# EAGLE design UTJ-1 (EAGLE 9.4.2)
DESIGNER: Bradley L. Davis; PART_NUMBER: 68-0014; PROJECT: Solar Cell Simulator; REV: 1.0.0
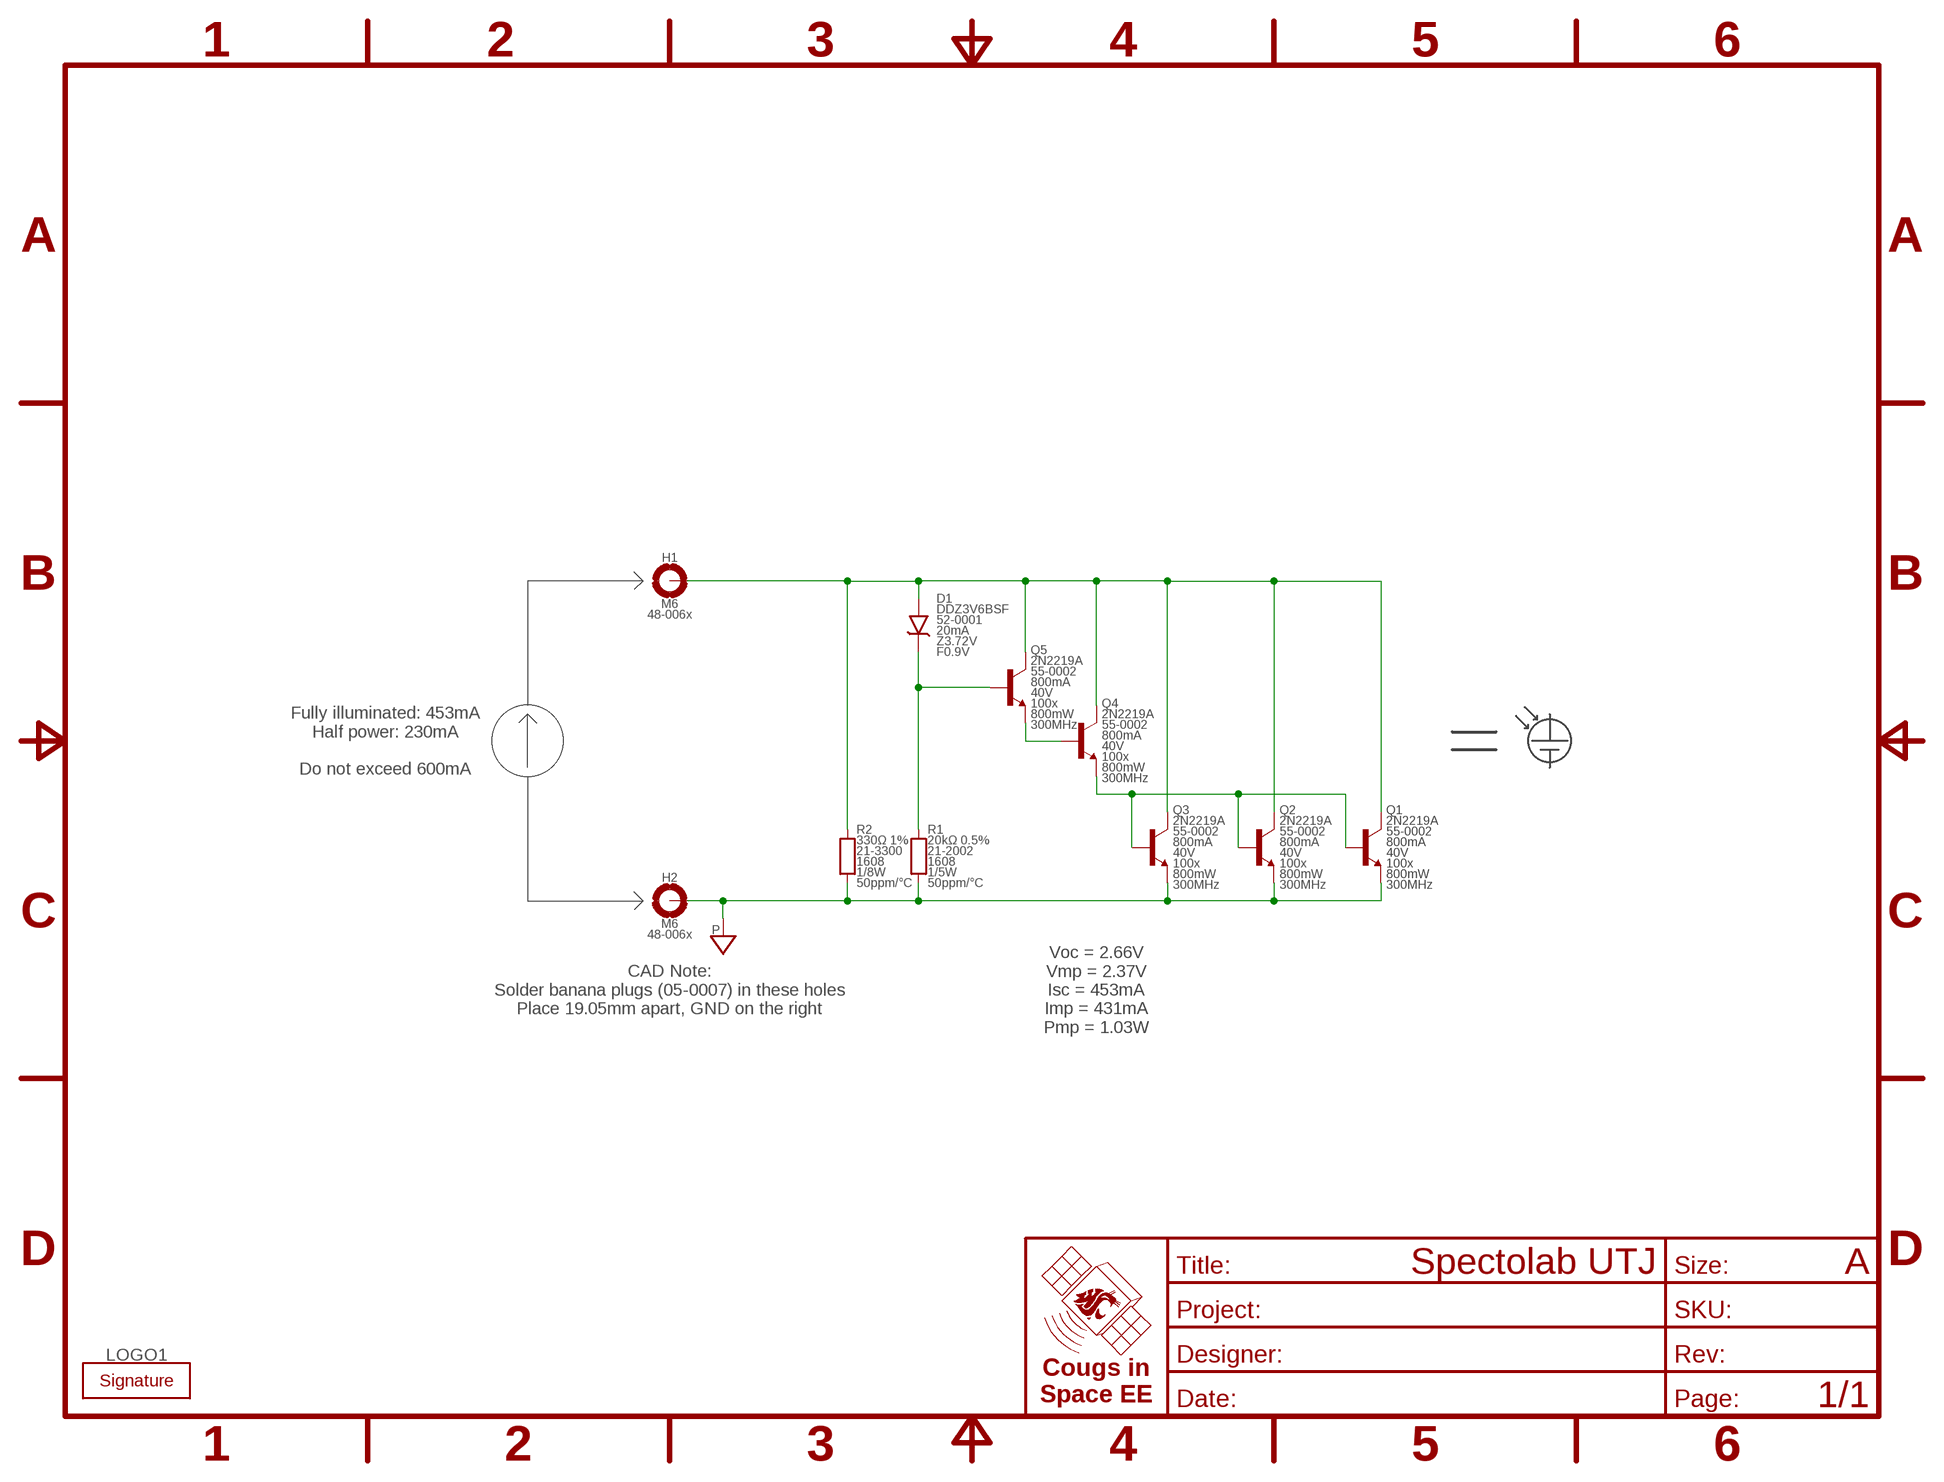
[diagram p0: schematic, sheet 1]
FRAME1 (FRAME-A): TITLE: Spectolab UTJ

## Parts
D1  DDZ3V6BSF  DIODE-ZENER-V-DDZ3V6BSF-SOD323F  [SOD323F]
H1  M6  MOUNTING_HOLE-6.6  [MOUNTING_HOLE-6.6]
H2  M6  MOUNTING_HOLE-6.6  [MOUNTING_HOLE-6.6]
LOGO1  SIGNATUREBRADLEY  [SIGN-BRADLEY]
Q1  2N2219A  BJT-NPN-2N2219A-TO-39  [TO-39]
Q2  2N2219A  BJT-NPN-2N2219A-TO-39  [TO-39]
Q3  2N2219A  BJT-NPN-2N2219A-TO-39  [TO-39]
Q4  2N2219A  BJT-NPN-2N2219A-TO-39  [TO-39]
Q5  2N2219A  BJT-NPN-2N2219A-TO-39  [TO-39]
R1  20kΩ 0.5%  RES-V-20K-1608  [1608]
R2  330Ω 1%  RES-V-330R-1608  [1608]

## Nets
CELL+: D1.A H1.1(MOUNT) H1.V1(MOUNT) H1.V2(MOUNT) H1.V3(MOUNT) H1.V4(MOUNT) H1.V5(MOUNT) H1.V6(MOUNT) H1.V7(MOUNT) H1.V8(MOUNT) H1.V9(MOUNT) H1.V10(MOUNT) H1.V11(MOUNT) H1.V12(MOUNT) H1.V13(MOUNT) H1.V14(MOUNT) H1.V15(MOUNT) H1.V16(MOUNT) Q1.3(C) Q2.3(C) Q3.3(C) Q4.3(C) Q5.3(C) R2.2
EMITTER-1: Q4.2(B) Q5.1(E)
EMITTER-2: Q1.2(B) Q2.2(B) Q3.2(B) Q4.1(E)
PGND: H2.1(MOUNT) H2.V1(MOUNT) H2.V2(MOUNT) H2.V3(MOUNT) H2.V4(MOUNT) H2.V5(MOUNT) H2.V6(MOUNT) H2.V7(MOUNT) H2.V8(MOUNT) H2.V9(MOUNT) H2.V10(MOUNT) H2.V11(MOUNT) H2.V12(MOUNT) H2.V13(MOUNT) H2.V14(MOUNT) H2.V15(MOUNT) H2.V16(MOUNT) Q1.1(E) Q2.1(E) Q3.1(E) R1.1 R2.1
ZENER_C: D1.C Q5.2(B) R1.2

## Notes on the sheet
- Fully illuminated: 453mA
  Half power: 230mA
  
  Do not exceed 600mA
- CAD Note:
  Solder banana plugs (05-0007) in these holes
  Place 19.05mm apart, GND on the right
- Voc = 2.66V
  Vmp = 2.37V
  Isc = 453mA
  Imp = 431mA
  Pmp = 1.03W

## Library data of the parts
D1 = CougsInSpace-DiscreteSemi:DIODE-ZENER-V: Diode Zener - Vertical; CURRENT: 20mA; SKU: 52-0001; VF: F0.9V; VZ: Z3.72V
H1 H2 = CougsInSpace-Hardware:MOUNTING_HOLE: Mounting Hole; SKU: 48-006x
LOGO1 = CougsInSpace-Aesthetics:SIGNATURE: Designer's (Artist's) Signature
Q1-Q5 = CougsInSpace-DiscreteSemi:BJT-NPN: Bipolar Junction Transistor - NPN; FREQ: 300MHz; GAIN: 100x; IMAX: 800mA; POWER: 800mW; SKU: 55-0002; VMAX: 40V
R1 = CougsInSpace-Resistors:RES-V: Resistor Vertical; PACKAGE: 1608; POWER: 1/5W; SKU: 21-2002; TEMP: 50ppm/°C
R2 = CougsInSpace-Resistors:RES-V: Resistor Vertical; PACKAGE: 1608; POWER: 1/8W; SKU: 21-3300; TEMP: 50ppm/°C

## Board
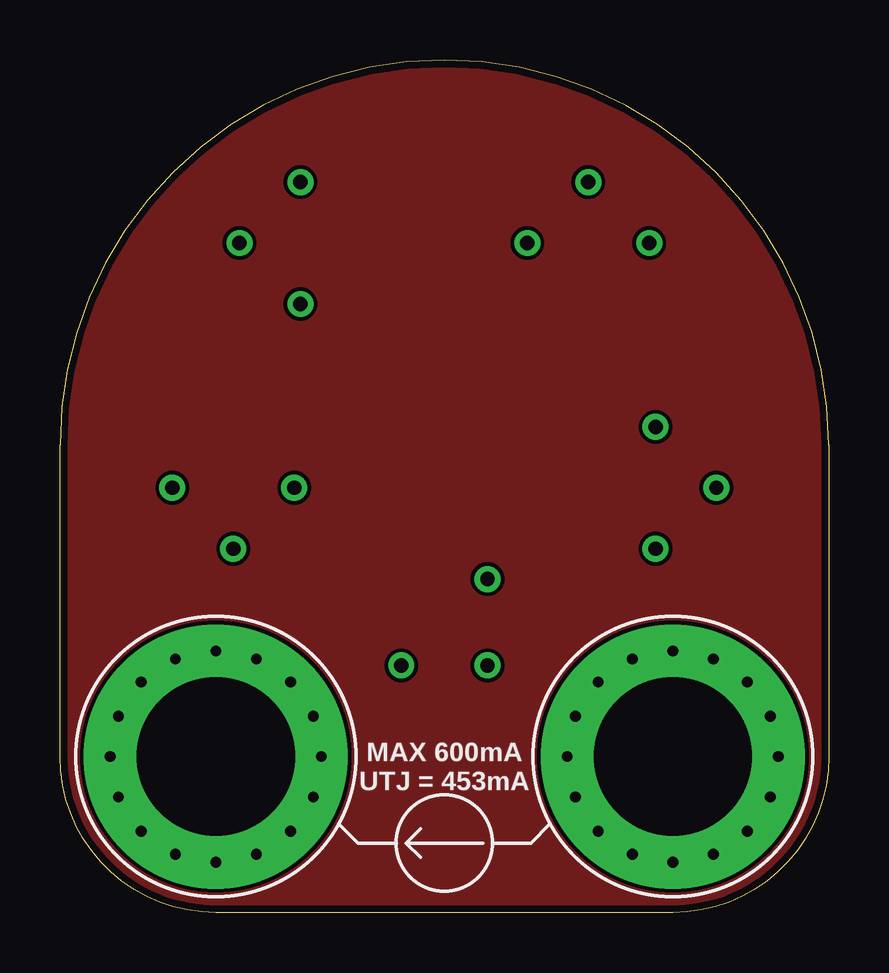
[diagram p1: board, top side]
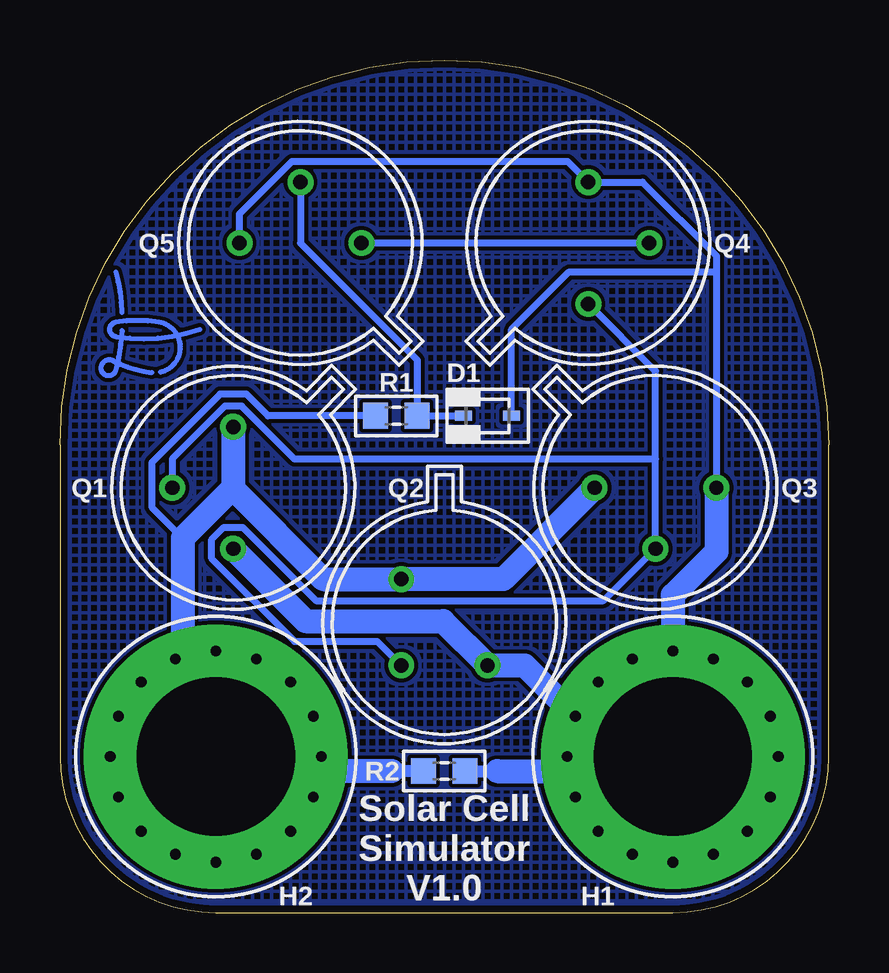
[diagram p2: board, bottom side, seen from below]

Size 32.05 x 35.52 mm. Coordinates in mm from the lower left corner, seen from the top.
Outline: 32.05,19.5 32.05,6.5 arc-90 25.55,0 6.5,0 arc-90 0,6.5 0,19.5 arc-180 32.05,19.5
Copper layers (1*16): Top 0.035mm / dielectric 1.6mm / Bottom 0.035mm
Design rules "CougsInSpace *": minimum track width 0.16mm, minimum drill 0.3mm, track to track 0.16mm, track to pad 0.16mm, pad to pad 0.16mm, via to via 0.16mm, smd to smd 0mil, copper to edge 0.3mm, drill to drill 0.3mm, minimum pad ring 0.15mm, minimum via ring 0.15mm, stop-mask expansion 0mil, vias tented up to drill 1mm, thermal gap 0.25mm

### Footprints (pad centres in the part's own frame; a part is rotated, then mirrored left to right if it is on the bottom)
SOD323F = smd 0.71 x 0.403: A 1,0; C -1,0
MOUNTING_HOLE-6.6 = drill 6.6 pad 11: 1 0,0 | drill 0.45: V1 4.4,0; V2 4.065,1.684; V3 3.111,3.111; V4 1.684,4.065; V5 0,4.4; V6 -1.684,4.065; V7 -3.111,3.111; V8 -4.065,1.684; V9 -4.4,0; V10 -4.065,-1.684; V11 -3.111,-3.111; V12 -1.684,-4.065; V13 0,-4.4; V14 1.684,-4.065; V15 3.111,-3.111; V16 4.065,-1.684
TO-39 = drill 0.6: 1 2.54,0; 2 0,2.54; 3 -2.54,0
1608 = smd 1.05 x 1.08: 1 -0.865,0; 2 0.865,0

### Placement (x,y rotation side)
D1  14.22,20.7 0 bottom
H1  6.5,6.5 0 top
H2  25.55,6.5 0 top
LOGO1  28.22,24.5 0 bottom
Q1  24.82,17.7 90 bottom
Q2  16.02,12.1 135 bottom
Q3  7.22,17.7 180 bottom
Q4  10.02,27.9 270 bottom
Q5  22.02,27.9 0 bottom
R1  18.02,20.7 0 bottom
R2  16.02,5.9 0 bottom

### Tracks (layer width: path | path; a pad name or v marks a point on that pad's centre or on a via)
BALANCING-BOTTOM
  pour Bottom (hatched): 6.5,0 arc-90 0,6.5 0,19.5 arc-180 32.05,19.5 32.05,6.5 arc-90 25.55,0
BALANCING-TOP
  pour Top: 6.5,0 arc-90 0,6.5 0,19.5 arc-180 32.05,19.5 32.05,6.5 arc-90 25.55,0
CELL+
  Top 0.5: H1.1 H1.V5 | H1.1 H1.V3 | H1.1 H1.V1 | 8.18,4.82 H1.V15 | H1.1 H1.V13 | H1.1 H1.V11 | H1.1 H1.V9 | H1.1 H1.V7 | 4.82,8.18 H1.V6 | H1.1 4.82,8.18 | 4.82,8.18 H1.V8 | 8.18,8.18 H1.V2 | H1.1 8.18,8.18 | 8.18,8.18 H1.V4 | H1.V14 8.18,4.82 | 4.82,4.82 H1.V10 | H1.1 4.82,4.82 | 4.82,4.82 H1.V12 | H1.1 8.18,4.82 | 8.18,4.82 H1.V16
  Bottom 0.3: 4.68,26.7 4.68,27.36 7.76,30.44 Q4.3 10.88,31.3 22.38,31.3 24.56,29.11 Q5.3 | 4.68,26.7 Q3.3 | D1.A 13.22,24.3 10.82,26.7 4.68,26.7
  Bottom 0.5: R2.2 13.82,5.9
  Bottom 1: 13.82,5.9 11.5,5.9 H1.V1 | Q1.3 21.81,12.15 16.07,12.15 Q2.3 | Q2.3 | Q3.3 4.68,15.04 6.5,13.22 H1.V5 | Q2.3 12.68,10.3 H1.V2
EMITTER-1
  Bottom 0.3: Q4.2 Q5.1
EMITTER-2
  Bottom 0.3: Q2.2 18.82,11.3 22.28,11.3 25.72,14.75 25.72,15.55 25.22,16.05 24.42,16.05 21.38,13 9.38,13 Q3.2 7.22,18.9 | 7.22,18.9 7.22,22.56 Q4.1 | 7.22,18.9 22.27,18.9 24.47,21.1 25.17,21.1 27.36,18.91 Q1.2
PGND
  Top 0.5: 23.87,8.18 H2.V6 | H2.1 23.87,8.18 | 23.87,8.18 H2.V8 | H2.1 H2.V5 | H2.1 H2.V3 | 27.23,8.18 H2.V4 | H2.1 27.23,8.18 | 27.23,8.18 H2.V2 | H2.1 H2.V1 | 27.23,4.82 H2.V14 | H2.1 27.23,4.82 | 27.23,4.82 H2.V16 | H2.1 H2.V15 | H2.1 H2.V13 | 23.87,4.82 H2.V12 | H2.1 H2.V11 | H2.1 23.87,4.82 | 23.87,4.82 H2.V10 | H2.1 H2.V9 | H2.1 H2.V7
  Bottom 0.3: R1.1 23.38,20.7 24.27,21.6 25.38,21.6 28.22,18.75 28.22,16.9 26.92,15.6
  Bottom 0.5: R2.1 18.22,5.9
  Bottom 1: 18.22,5.9 20.55,5.9 H2.V9 | Q3.1 13.57,13.9 Q2.1 21.07,13.9 24.85,17.68 | Q1.1 24.82,17.7 24.85,17.68 | 24.85,17.68 26.92,15.6 26.92,10.87 H2.V4
ZENER_C
  Bottom 0.3: D1.C R1.2 17.16,23.04 22.02,27.9 Q5.2

### Text on the board
tPlace: MAX 600mA / UTJ = 453mA
bPlace: Solar Cell / Simulator / V1.0